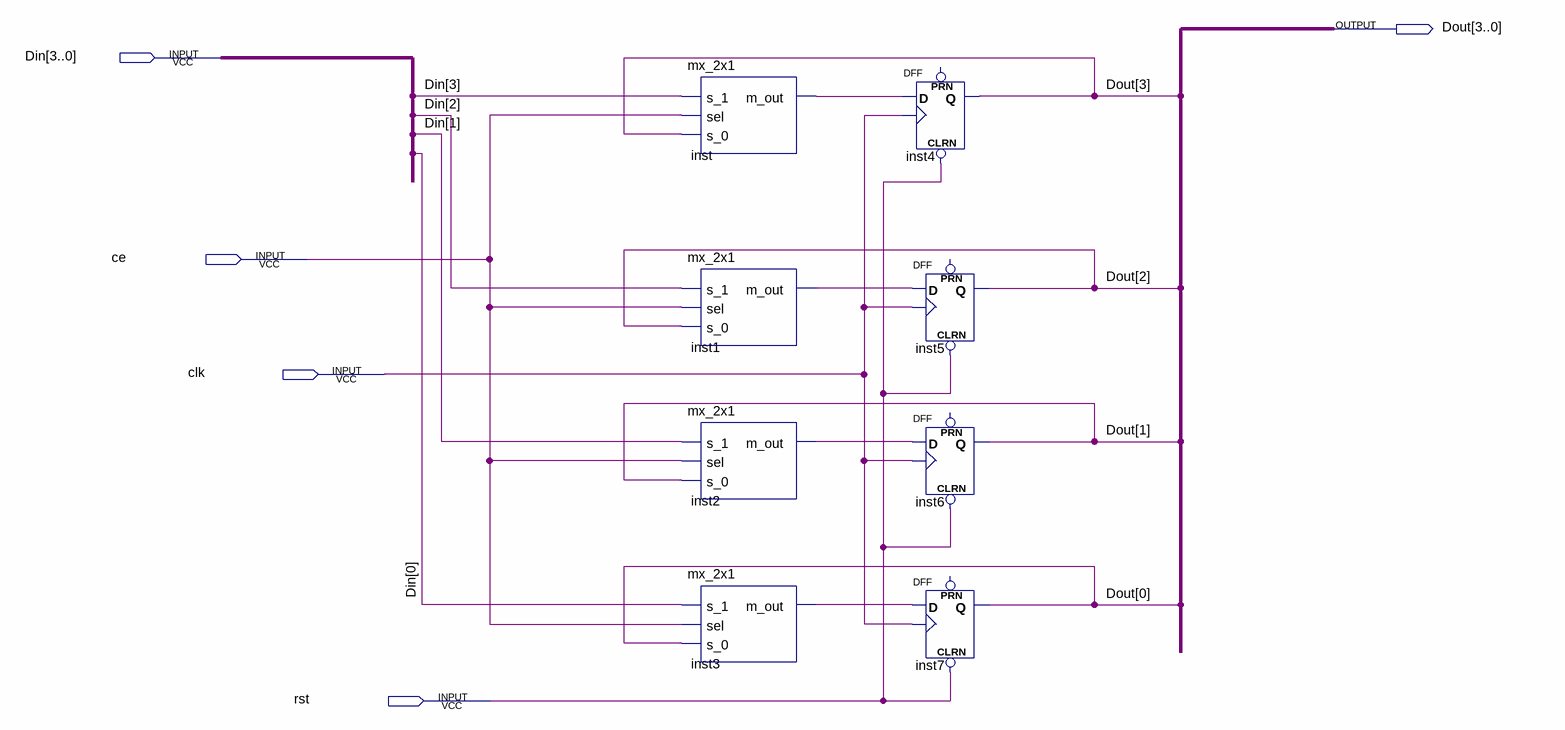
[diagram p0: schematic sheet]
// Quartus schematic fourbit_register_ce.bdf as structural Verilog: 8 symbols, 5 pins
module fourbit_register_ce (
  input  [3:0] Din,
  input  ce,
  input  clk,
  input  rst,
  output [3:0] Dout
);

  wire inst1_m_out, inst2_m_out, inst3_m_out, inst_m_out;

  mx_2x1 inst (.s_1(Din[3]), .sel(ce), .s_0(Dout[3]), .m_out(inst_m_out));
  mx_2x1 inst1 (.s_1(Din[2]), .sel(ce), .s_0(Dout[2]), .m_out(inst1_m_out));
  mx_2x1 inst2 (.s_1(Din[1]), .sel(ce), .s_0(Dout[1]), .m_out(inst2_m_out));
  mx_2x1 inst3 (.s_1(Din[0]), .sel(ce), .s_0(Dout[0]), .m_out(inst3_m_out));
  DFF inst4 (.CLRN(rst), .CLK(clk), .D(inst_m_out), .Q(Dout[3]));  // open: PRN
  DFF inst5 (.CLRN(rst), .CLK(clk), .D(inst1_m_out), .Q(Dout[2]));  // open: PRN
  DFF inst6 (.CLRN(rst), .CLK(clk), .D(inst2_m_out), .Q(Dout[1]));  // open: PRN
  DFF inst7 (.CLRN(rst), .CLK(clk), .D(inst3_m_out), .Q(Dout[0]));  // open: PRN
endmodule
